# Altium schematic sheet 03- Power Supply.SchDoc: Power Supply
size 420 x 297 mm; DocumentNumber: 2; Revision: 1.0; SheetNumber: 3; SheetTotal: 13; Project: LOW LEVEL ECU
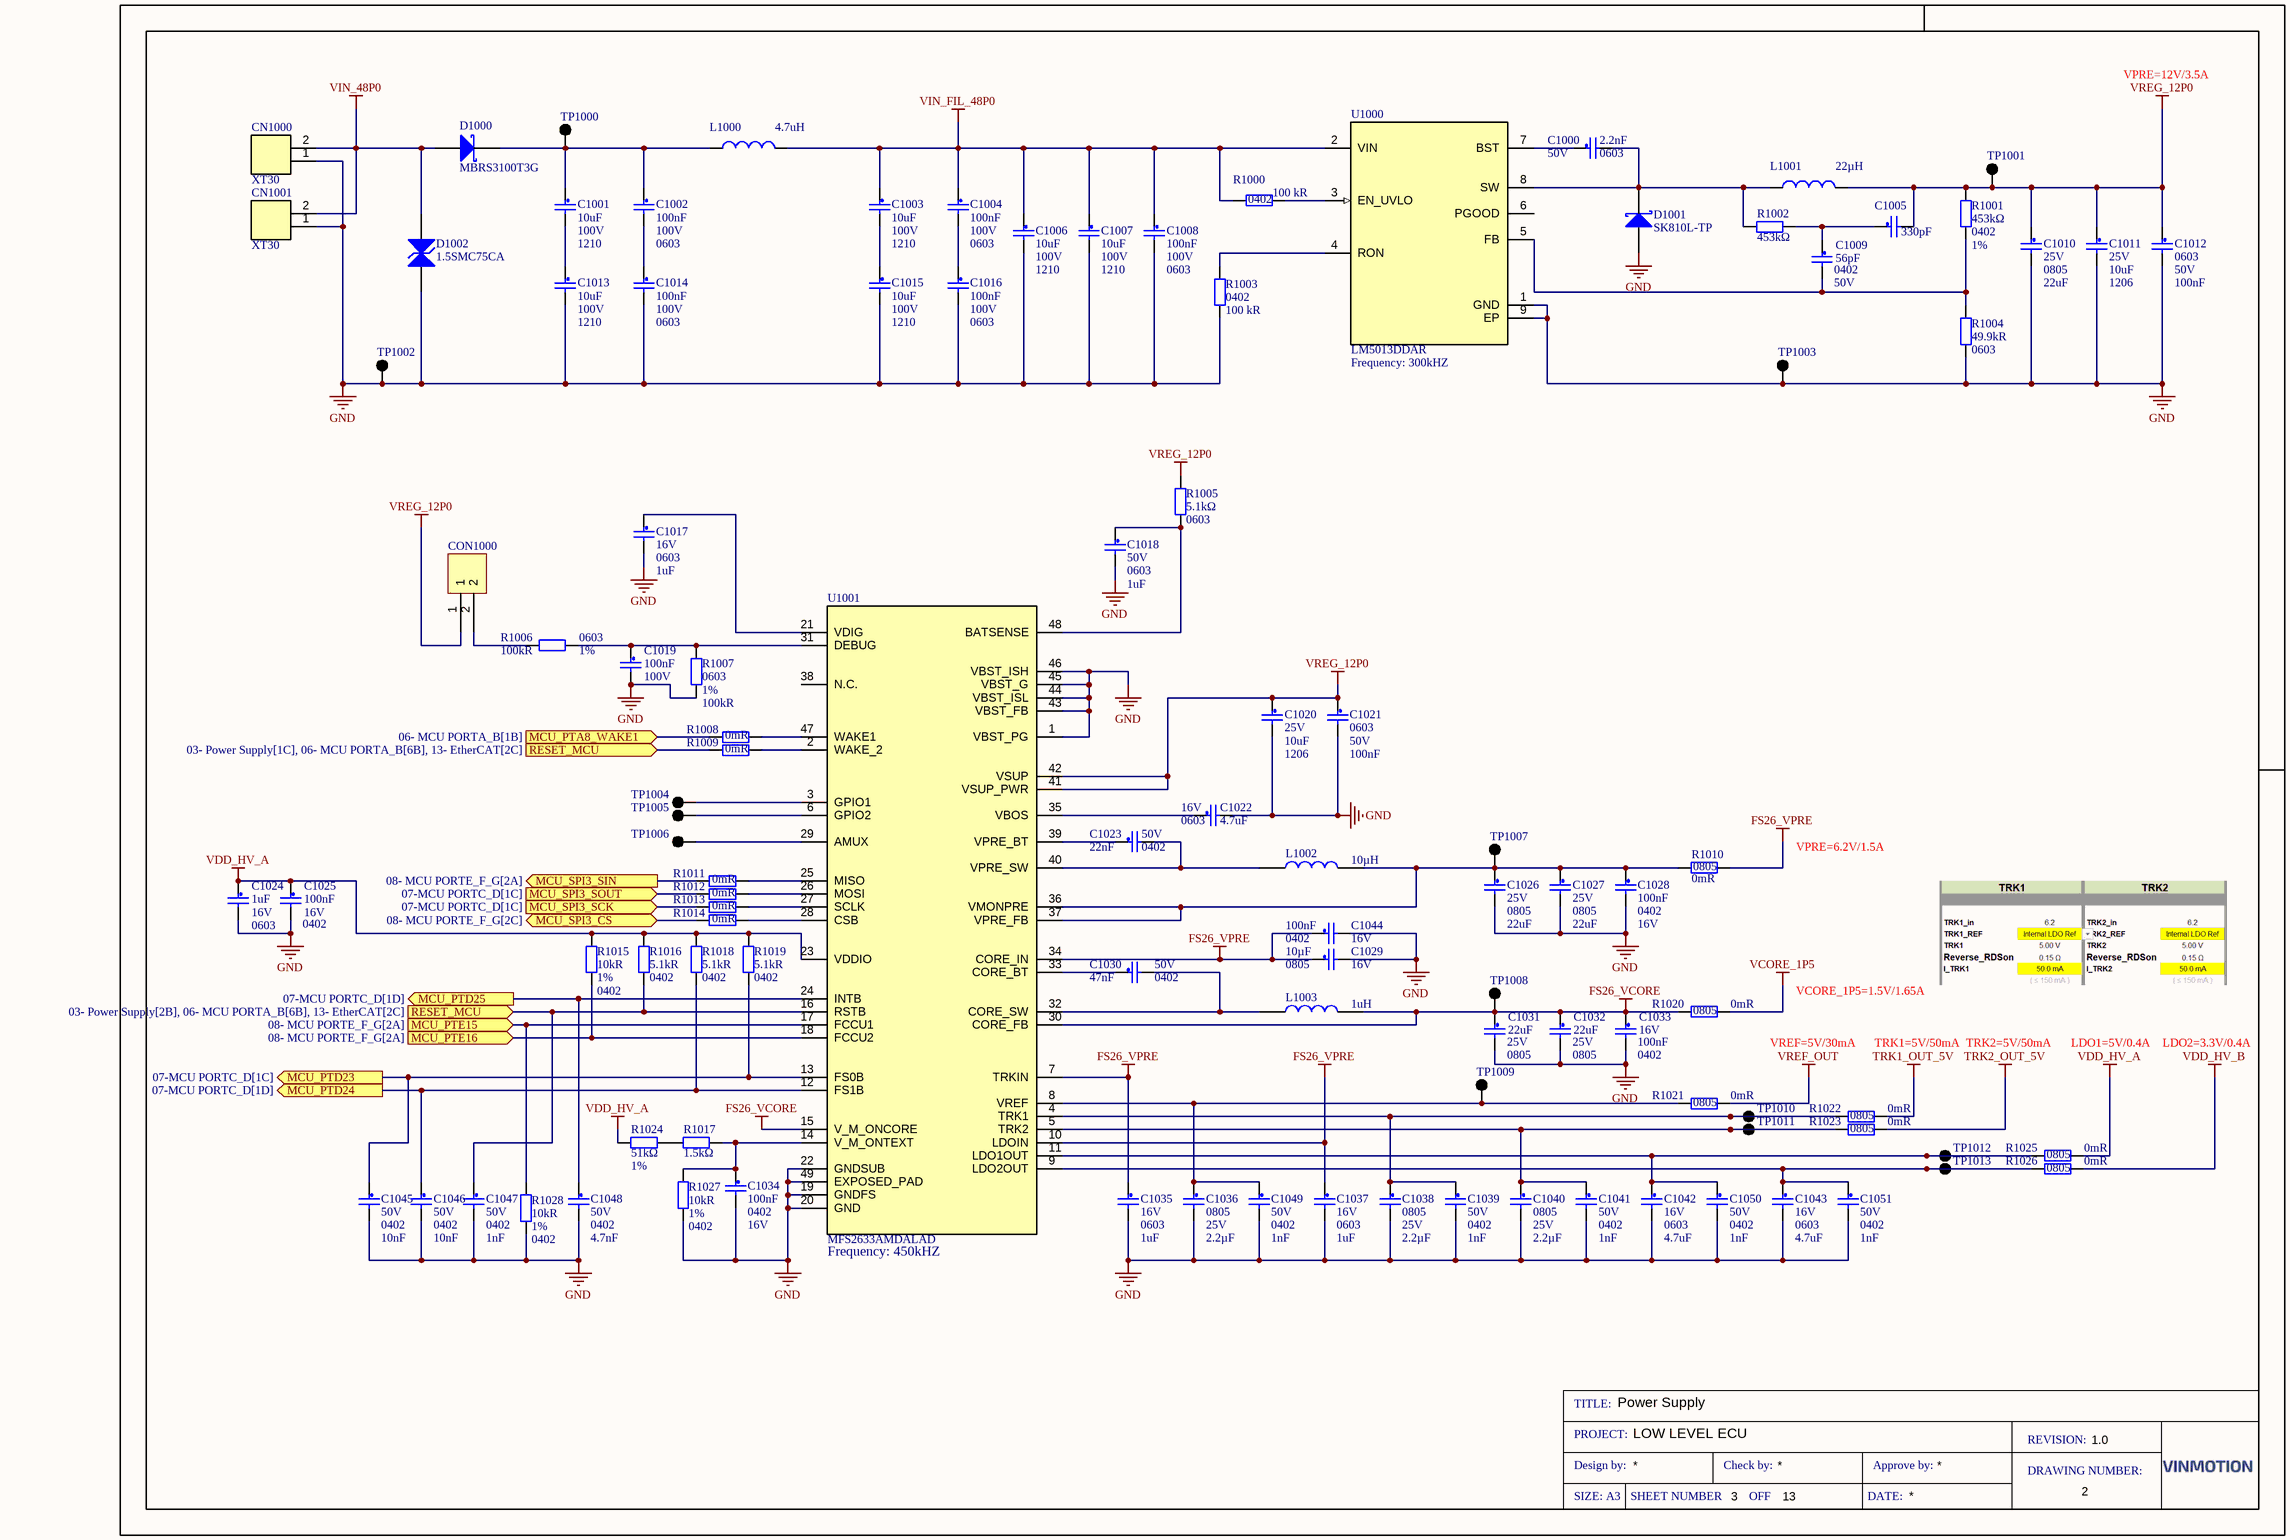
[diagram p0: 03- Power Supply.SchDoc]

## Parts
C1000  Voltage Rating: 50V  Case/Package: 0603  Capacitance: 2.2nF  [CAP0603]  (hidden comment: CL10B222KB8WPNC)
C1001  value 10uF  DC Voltage Rated: 100V  Package: 1210  [CAP1210]  (hidden comment: C3225X7R2A106K250AC)
C1002  value 100nF  Rated DC Voltage (URdc): 100V  Case/Package: 0603  [CAP0603]  (hidden comment: CC0603KRX7R0BB104)
C1003  value 10uF  DC Voltage Rated: 100V  Package: 1210  [CAP1210]  (hidden comment: C3225X7R2A106K250AC)
C1004  value 100nF  Rated DC Voltage (URdc): 100V  Case/Package: 0603  [CAP0603]  (hidden comment: CC0603KRX7R0BB104)
C1005  Capacitance: 330pF  [CAP0603]  (hidden comment: GCM1885C2A331JA16D)
C1006  value 10uF  DC Voltage Rated: 100V  Package: 1210  [CAP1210]  (hidden comment: C3225X7R2A106K250AC)
C1007  value 10uF  DC Voltage Rated: 100V  Package: 1210  [CAP1210]  (hidden comment: C3225X7R2A106K250AC)
C1008  value 100nF  Rated DC Voltage (URdc): 100V  Case/Package: 0603  [CAP0603]  (hidden comment: CC0603KRX7R0BB104)
C1009  Case/Package: 0402  Voltage Rating: 50V  Capacitance: 56pF  [CAP0402]  (hidden comment: GCM1555C1H560JA16D)
C1010  Voltage Rating: 25V  Case/Package: 0805  Capacitance: 22uF  [CAP0805]  (hidden comment: GRM21BR61E226ME44K)
C1011  Voltage Rating (DC): 25V  Capacitance: 10uF  Case Code (Imperial): 1206  [CAP1206]  (hidden comment: GCM31CC71E106KA03L)
C1012  Case/Package: 0603  Voltage Rating: 50V  Capacitance: 100nF  [CAP0603]  (hidden comment: CL10B104KB8WPNC)
C1013  value 10uF  DC Voltage Rated: 100V  Package: 1210  [CAP1210]  (hidden comment: C3225X7R2A106K250AC)
C1014  value 100nF  Rated DC Voltage (URdc): 100V  Case/Package: 0603  [CAP0603]  (hidden comment: CC0603KRX7R0BB104)
C1015  value 10uF  DC Voltage Rated: 100V  Package: 1210  [CAP1210]  (hidden comment: C3225X7R2A106K250AC)
C1016  value 100nF  Rated DC Voltage (URdc): 100V  Case/Package: 0603  [CAP0603]  (hidden comment: CC0603KRX7R0BB104)
C1017  Voltage Rating: 16V  Case/Package: 0603  Capacitance: 1uF  [CAP0603]  (hidden comment: CGA3E1X7R1C105K080AC)
C1018  Voltage Rating: 50V  Case/Package: 0603  Capacitance: 1uF  [CAP0603]  (hidden comment: CL10A105KB8NNNC)
C1019  value 100nF  Rated DC Voltage (URdc): 100V  [CAP0603]  (hidden comment: CC0603KRX7R0BB104)
C1020  Voltage Rating (DC): 25V  Capacitance: 10uF  Case Code (Imperial): 1206  [CAP1206]  (hidden comment: GCM31CC71E106KA03L)
C1021  Case/Package: 0603  Voltage Rating: 50V  Capacitance: 100nF  [CAP0603]  (hidden comment: CL10B104KB8WPNC)
C1022  Voltage Rating: 16V  Case/Package: 0603  Capacitance: 4.7uF  [CAP0603]  (hidden comment: GRT188C81C475KE13D)
C1023  Voltage Rating: 50V  Case/Package: 0402  Capacitance: 22nF  [CAP0402]  (hidden comment: GCM155R71H223KA55D)
C1024  Voltage Rating: 16V  Case/Package: 0603  Capacitance: 1uF  [CAP0603]  (hidden comment: CGA3E1X7R1C105K080AC)
C1025  Capacitance: 100nF  Case/Package: 0402  Voltage Rating (DC): 16V  [CAP0402]  (hidden comment: 0402YC104KAT2A)
C1026  Voltage Rating: 25V  Case/Package: 0805  Capacitance: 22uF  [CAP0805]  (hidden comment: GRM21BR61E226ME44K)
C1027  Voltage Rating: 25V  Case/Package: 0805  Capacitance: 22uF  [CAP0805]  (hidden comment: GRM21BR61E226ME44K)
C1028  Capacitance: 100nF  Case/Package: 0402  Voltage Rating (DC): 16V  [CAP0402]  (hidden comment: 0402YC104KAT2A)
C1029  value 10µF  Case/Package: 0805  Voltage Rating: 16V  [CAP0805]  (hidden comment: GRM21BZ71C106KE15L)
C1030  Voltage Rating: 50V  Case/Package: 0402  Capacitance: 47nF  [CAP0402]  (hidden comment: UMK105B7473KVHF)
C1031  Voltage Rating: 25V  Case/Package: 0805  Capacitance: 22uF  [CAP0805]  (hidden comment: GRM21BR61E226ME44K)
C1032  Voltage Rating: 25V  Case/Package: 0805  Capacitance: 22uF  [CAP0805]  (hidden comment: GRM21BR61E226ME44K)
C1033  Capacitance: 100nF  Case/Package: 0402  Voltage Rating (DC): 16V  [CAP0402]  (hidden comment: 0402YC104KAT2A)
C1034  Capacitance: 100nF  Case/Package: 0402  Voltage Rating (DC): 16V  [CAP0402]  (hidden comment: 0402YC104KAT2A)
C1035  Voltage Rating: 16V  Case/Package: 0603  Capacitance: 1uF  [CAP0603]  (hidden comment: CGA3E1X7R1C105K080AC)
C1036  Case/Package: 0805  Voltage Rating: 25V  Capacitance: 2.2µF  [CAP0805]  (hidden comment: GCM21BR71E225KA73L)
C1037  Voltage Rating: 16V  Case/Package: 0603  Capacitance: 1uF  [CAP0603]  (hidden comment: CGA3E1X7R1C105K080AC)
C1038  Case/Package: 0805  Voltage Rating: 25V  Capacitance: 2.2µF  [CAP0805]  (hidden comment: GCM21BR71E225KA73L)
C1039  Voltage Rating: 50V  Case/Package: 0402  Capacitance: 1nF  [CAP0402]  (hidden comment: UMK105B7102KVHF)
C1040  Case/Package: 0805  Voltage Rating: 25V  Capacitance: 2.2µF  [CAP0805]  (hidden comment: GCM21BR71E225KA73L)
C1041  Voltage Rating: 50V  Case/Package: 0402  Capacitance: 1nF  [CAP0402]  (hidden comment: UMK105B7102KVHF)
C1042  Voltage Rating: 16V  Case/Package: 0603  Capacitance: 4.7uF  [CAP0603]  (hidden comment: GRT188C81C475KE13D)
C1043  Voltage Rating: 16V  Case/Package: 0603  Capacitance: 4.7uF  [CAP0603]  (hidden comment: GRT188C81C475KE13D)
C1044  Capacitance: 100nF  Case/Package: 0402  Voltage Rating (DC): 16V  [CAP0402]  (hidden comment: 0402YC104KAT2A)
C1045  Voltage Rating: 50V  Case/Package: 0402  Capacitance: 10nF  [CAP0402]  (hidden comment: GCM155R71H103KA55D)
C1046  Voltage Rating: 50V  Case/Package: 0402  Capacitance: 10nF  [CAP0402]  (hidden comment: GCM155R71H103KA55D)
C1047  Voltage Rating: 50V  Case/Package: 0402  Capacitance: 1nF  [CAP0402]  (hidden comment: UMK105B7102KVHF)
C1048  Voltage Rating: 50V  Case/Package: 0402  Capacitance: 4.7nF  [CAP0402]  (hidden comment: UMK105B7472KVHF)
C1049  Voltage Rating: 50V  Case/Package: 0402  Capacitance: 1nF  [CAP0402]  (hidden comment: UMK105B7102KVHF)
C1050  Voltage Rating: 50V  Case/Package: 0402  Capacitance: 1nF  [CAP0402]  (hidden comment: UMK105B7102KVHF)
C1051  Voltage Rating: 50V  Case/Package: 0402  Capacitance: 1nF  [CAP0402]  (hidden comment: UMK105B7102KVHF)
CN1000  XT30  [XT30]
CN1001  XT30  [XT30]
CON1000  61300211121  [61300211121-Footprint-1]  (value not drawn)
D1000  MBRS3100T3G  [DIOM6959X26N]
D1001  SK810L-TP  [SMC]
D1002  1.5SMC75CA  [LITTLEFUSE_DO-214AB (SMCJ)_TPSMD18CA_N]
L1000  Inductance: 4.7uH  [INDP4949X20N]  (hidden comment: NRS5040T4R7NMGKV)
L1001  value 22µH  [INDP11X10X6]  (hidden comment: SRP1050WA-220M)
L1002  value 10µH  [INDC548X528X510]  (hidden comment: XAL5050-103MEC)
L1003  value 1uH  [INDP2016X12N]  (hidden comment: TFM201610ALMA1R0MTAA)
R1000  Case/Package: 0402  Resistance: 100 kR  [RES0402]  (hidden comment: RK73B1ETTP104J)
R1001  value 453kΩ  Case/Package: 0402  Tolerance: 1%  [RES0402]  (hidden comment: RC0402FR-13453KL)
R1002  value 453kΩ  [RES0603]  (hidden comment: RC0603FR-07453KL)
R1003  Case/Package: 0402  Resistance: 100 kR  [RES0402]  (hidden comment: RK73B1ETTP104J)
R1004  Resistance: 49.9kR  Case/Package: 0603  [RES0603]  (hidden comment: CRCW060349K9FKEAHP)
R1005  value 5.1kΩ  Case/Package: 0603  [RES0603]  (hidden comment: ESR03EZPJ512)
R1006  Case/Package: 0603  Tolerance: 1%  Resistance: 100kR  [RES0603]  (hidden comment: RMCF0603FG100K)
R1007  Case/Package: 0603  Tolerance: 1%  Resistance: 100kR  [RES0603]  (hidden comment: RMCF0603FG100K)
R1008  Resistance: 0mR  [RES0402]  (hidden comment: RMCF0402ZT0R00)
R1009  Resistance: 0mR  [RES0402]  (hidden comment: RMCF0402ZT0R00)
R1010  Resistance: 0mR  Case/Package: 0805  [RES0805]  (hidden comment: RMCF0805ZT0R00)
R1011  Resistance: 0mR  [RES0402]  (hidden comment: RMCF0402ZT0R00)
R1012  Resistance: 0mR  [RES0402]  (hidden comment: RMCF0402ZT0R00)
R1013  Resistance: 0mR  [RES0402]  (hidden comment: RMCF0402ZT0R00)
R1014  Resistance: 0mR  [RES0402]  (hidden comment: RMCF0402ZT0R00)
R1015  value 10kR  Tolerance: 1%  Case/Package: 0402  [RES0402]  (hidden comment: RMCF0402FT10K0)
R1016  Resistance: 5.1kR  Case/Package: 0402  [RES0402]  (hidden comment: MCR01MZPF5101)
R1017  value 1.5kΩ  [RES0402]  (hidden comment: RC0402FR-071K5L)
R1018  Resistance: 5.1kR  Case/Package: 0402  [RES0402]  (hidden comment: MCR01MZPF5101)
R1019  Resistance: 5.1kR  Case/Package: 0402  [RES0402]  (hidden comment: MCR01MZPF5101)
R1020  Resistance: 0mR  Case/Package: 0805  [RES0805]  (hidden comment: RMCF0805ZT0R00)
R1021  Resistance: 0mR  Case/Package: 0805  [RES0805]  (hidden comment: RMCF0805ZT0R00)
R1022  Resistance: 0mR  Case/Package: 0805  [RES0805]  (hidden comment: RMCF0805ZT0R00)
R1023  Resistance: 0mR  Case/Package: 0805  [RES0805]  (hidden comment: RMCF0805ZT0R00)
R1024  value 51kΩ  Tolerance: 1%  [RES0402]  (hidden comment: AC0402FR-0751KL)
R1025  Resistance: 0mR  Case/Package: 0805  [RES0805]  (hidden comment: RMCF0805ZT0R00)
R1026  Resistance: 0mR  Case/Package: 0805  [RES0805]  (hidden comment: RMCF0805ZT0R00)
R1027  value 10kR  Tolerance: 1%  Case/Package: 0402  [RES0402]  (hidden comment: RMCF0402FT10K0)
R1028  value 10kR  Tolerance: 1%  Case/Package: 0402  [RES0402]  (hidden comment: RMCF0402FT10K0)
TP1000  TP  [TP-SMD-R1]  (value not drawn)  (no BOM)
TP1001  TP  [TP-SMD-R1]  (value not drawn)  (no BOM)
TP1002  TP  [TP-SMD-R1]  (value not drawn)  (no BOM)
TP1003  TP  [TP-SMD-R1]  (value not drawn)  (no BOM)
TP1004  TP  [TP-SMD-R1]  (value not drawn)  (no BOM)
TP1005  TP  [TP-SMD-R1]  (value not drawn)  (no BOM)
TP1006  TP  [TP-SMD-R1]  (value not drawn)  (no BOM)
TP1007  TP  [TP-SMD-R1]  (value not drawn)  (no BOM)
TP1008  TP  [TP-SMD-R1]  (value not drawn)  (no BOM)
TP1009  TP  [TP-SMD-R1]  (value not drawn)  (no BOM)
TP1010  TP  [TP-SMD-R1]  (value not drawn)  (no BOM)
TP1011  TP  [TP-SMD-R1]  (value not drawn)  (no BOM)
TP1012  TP  [TP-SMD-R1]  (value not drawn)  (no BOM)
TP1013  TP  [TP-SMD-R1]  (value not drawn)  (no BOM)
U1000  LM5013DDAR  [SOIC-8]
U1001  MFS2633AMDALAD  [48-LQFP Exposed Pad(7x7)]

## Ports
MCU_PTA8_WAKE1 (in, see 06- MCU PORTA_B[1B]), MCU_PTD23 (out, see 07-MCU PORTC_D[1C]), MCU_PTD24 (out, see 07-MCU PORTC_D[1D]), MCU_PTD25 (out, see 07-MCU PORTC_D[1D]), MCU_PTE15 (in, see 08- MCU PORTE_F_G[2A]), MCU_PTE16 (in, see 08- MCU PORTE_F_G[2A]), MCU_SPI3_CS (bidir, see 08- MCU PORTE_F_G[2C]), MCU_SPI3_SCK (in, see 07-MCU PORTC_D[1C]), MCU_SPI3_SIN (out, see 08- MCU PORTE_F_G[2A]), MCU_SPI3_SOUT (in, see 07-MCU PORTC_D[1C]), RESET_MCU (in, see 03- Power Supply[1C], 06- MCU PORTA_B[6B], 13- EtherCAT[2C]), RESET_MCU (in, see 03- Power Supply[2B], 06- MCU PORTA_B[6B], 13- EtherCAT[2C])

## Nets
FS26_VCORE: C1031.1 C1032.1 C1033.1 L1003.2 R1020.1 TP1008.1 U1001.15(V_M_ONCORE) U1001.30(CORE_FB)
FS26_VPRE: C1029.1 C1035.1 C1037.1 C1044.1 R1010.2 U1001.7(TRKIN) U1001.10(LDOIN) U1001.34(CORE_IN)
GND: C1006.2 C1007.2 C1008.2 C1010.2 C1011.2 C1012.2 C1013.2 C1014.2 C1015.2 C1016.2 C1017.2 C1018.2 C1019.2 C1020.2 C1021.2 C1022.2 C1024.2 C1025.2 C1026.2 C1027.2 C1028.2 C1029.2 C1031.2 C1032.2 C1033.2 C1034.2 C1035.2 C1036.2 C1037.2 C1038.2 C1039.2 C1040.2 C1041.2 C1042.2 C1043.2 C1044.2 C1045.2 C1046.2 C1047.2 C1048.2 C1049.2 C1050.2 C1051.2 CN1000.1 CN1001.1 D1001.2(A) D1002.2 R1003.1 R1004.1 R1007.1 R1027.1 R1028.1 TP1002.1 TP1003.1 U1000.1(GND) U1000.9(EP) U1001.1(VBST_PG) U1001.19(GNDFS) U1001.20(GND) U1001.22(GNDSUB) U1001.43(VBST_FB) U1001.44(VBST_ISL) U1001.45(VBST_G) U1001.46(VBST_ISH) U1001.49(EXPOSED_PAD)
TRK1_OUT_5V: R1022.2
TRK2_OUT_5V: R1023.2
VCORE_1P5: R1020.2
VDD_HV_A: C1024.1 C1025.1 R1015.2 R1016.2 R1018.2 R1019.2 R1024.2 R1025.2 U1001.23(VDDIO)
VDD_HV_B: R1026.2
VIN_48P0: CN1000.2 CN1001.2 D1000.2(A) D1002.1
VIN_FIL_48P0: C1003.1 C1004.1 C1006.1 C1007.1 C1008.1 L1000.2 R1000.1 U1000.2(VIN)
VREF_OUT: R1021.2
VREG_12P0: C1005.2 C1010.1 C1011.1 C1012.1 C1020.1 C1021.1 CON1000.1 L1001.2 R1001.2 R1005.2 TP1001.1 U1001.41(VSUP_PWR) U1001.42(VSUP)
MCU_PTA8_WAKE1: R1008.1 ; port MCU_PTA8_WAKE1
MCU_PTD23: C1045.1 R1019.1 U1001.13(FS0B) ; port MCU_PTD23
MCU_PTD24: C1046.1 R1018.1 U1001.12(FS1B) ; port MCU_PTD24
MCU_PTD25: C1048.1 U1001.24(INTB) ; port MCU_PTD25
MCU_PTE15: R1028.2 U1001.17(FCCU1) ; port MCU_PTE15
MCU_PTE16: R1015.1 U1001.18(FCCU2) ; port MCU_PTE16
MCU_SPI3_CS: R1014.1 ; port MCU_SPI3_CS
MCU_SPI3_SCK: R1013.1 ; port MCU_SPI3_SCK
MCU_SPI3_SIN: R1011.1 ; port MCU_SPI3_SIN
MCU_SPI3_SOUT: R1012.1 ; port MCU_SPI3_SOUT
RESET_MCU: C1047.1 R1009.1 R1016.1 U1001.16(RSTB) ; port RESET_MCU
NetC1000_1: C1000.1 U1000.7(BST)
NetC1000_2: C1000.2 D1001.1(K) L1001.1 R1002.1 U1000.8(SW)
NetC1001_1: C1001.1 C1002.1 D1000.1(K) L1000.1 TP1000.1
NetC1001_2: C1001.2 C1013.1
NetC1002_2: C1002.2 C1014.1
NetC1003_2: C1003.2 C1015.1
NetC1004_2: C1004.2 C1016.1
NetC1005_1: C1005.1 C1009.1 R1002.2
NetC1009_2: C1009.2 R1001.1 R1004.2 U1000.5(FB)
NetC1017_1: C1017.1 U1001.21(VDIG)
NetC1018_1: C1018.1 R1005.1 U1001.48(BATSENSE)
NetC1019_1: C1019.1 R1006.2 R1007.2 U1001.31(DEBUG)
NetC1022_1: C1022.1 U1001.35(VBOS)
NetC1023_1: C1023.1 U1001.39(VPRE_BT)
NetC1023_2: C1023.2 L1002.1 U1001.40(VPRE_SW)
NetC1026_1: C1026.1 C1027.1 C1028.1 L1002.2 R1010.1 TP1007.1 U1001.36(VMONPRE) U1001.37(VPRE_FB)
NetC1030_1: C1030.1 U1001.33(CORE_BT)
NetC1030_2: C1030.2 L1003.1 U1001.32(CORE_SW)
NetC1034_1: C1034.1 R1017.1 R1027.2 U1001.14(V_M_ONTEXT)
NetC1036_1: C1036.1 C1049.1 R1021.1 TP1009.1 U1001.8(VREF)
NetC1038_1: C1038.1 C1039.1 R1022.1 TP1010.1 U1001.4(TRK1)
NetC1040_1: C1040.1 C1041.1 R1023.1 TP1011.1 U1001.5(TRK2)
NetC1042_1: C1042.1 C1050.1 R1025.1 TP1012.1 U1001.11(LDO1OUT)
NetC1043_1: C1043.1 C1051.1 R1026.1 TP1013.1 U1001.9(LDO2OUT)
NetCON1000_2: CON1000.2 R1006.1
NetR1000_2: R1000.2 U1000.3(EN_UVLO)
NetR1003_2: R1003.2 U1000.4(RON)
NetR1008_2: R1008.2 U1001.47(WAKE1)
NetR1009_2: R1009.2 U1001.2(WAKE_2)
NetR1011_2: R1011.2 U1001.25(MISO)
NetR1012_2: R1012.2 U1001.26(MOSI)
NetR1013_2: R1013.2 U1001.27(SCLK)
NetR1014_2: R1014.2 U1001.28(CSB)
NetR1017_2: R1017.2 R1024.1
NetTP1004_1: TP1004.1 U1001.3(GPIO1)
NetTP1005_1: TP1005.1 U1001.6(GPIO2)
NetTP1006_1: TP1006.1 U1001.29(AMUX)

Not connected (* = marked no-connect by the designer): U1000 6(PGOOD); U1001 38(N.C.)

## Notes on the sheet
- VPRE=12V/3.5A
- (near U1000) Frequency: 300kHZ
- VPRE=6.2V/1.5A
- VCORE_1P5=1.5V/1.65A
- VREF=5V/30mA
- TRK1=5V/50mA
- TRK2=5V/50mA
- LDO1=5V/0.4A
- LDO2=3.3V/0.4A
- (near U1001) Frequency: 450kHZ
- TITLE:
- PROJECT:
- Design by:
- Check by:
- Approve by:
- DRAWING NUMBER:
- REVISION:
- SIZE: A3
- SHEET NUMBER
- OFF
- DATE:

## Library data of the parts
C1000 = CMP-00248-3: CAP CER 2200PF 50V X7R 0603; Manufacturer 1: Samsung; Mount Type(SMD/TH): SMD; Crossable(YES/NO): YES; Tolerance: 10%; Width: 0.031inch; Mount: Surface Mount; Packaging: Tape and Reel; Dielectric: X7R; Max Operating Temperature: 125°C; Radiation Hardening: No; Thickness: 0.035inch; Min Operating Temperature: -55°C; Manufacturer Part Number 1: CL10B222KB8WPNC; Case Code (Metric): 1608; Ratings: AEC-Q200; Features: Soft Termination; Case Code (Imperial): 0603; Depth: 0.8mm; Length: 0.063inch; Height: 0.8mm; Lead Free: Lead Free; Voltage Rating (DC): 50V
C1001 C1003 C1006 C1007 C1013 C1015 = CMP-01079-1: CAP CER 10UF 100V X7R 1210; Manufacturer: TDK; Manufacturer Part Number: C3225X7R2A106K250AC; Category: Ceramic Capacitors
C1002 C1004 C1008 C1014 C1016 C1019 = CMP-01080-1: CAP CER 0.1UF 100V X7R 0603; Manufacturer: Yageo; Capacitor Type: Ceramic; Multilayer: Yes; Tolerance  (fill in as +-): 10%; JESD-609 Code: e3; Category: Ceramic Capacitors; Dielectric Material: Ceramic; Height: 0.8mm; Length: 1.6mm; Manufacturer Part Number: CC0603KRX7R0BB104; Max Operating Temperature: 125°C; Min Operating Temperature: -55°C; Mounting Technology: Surface Mount; Pins: 2; Package Shape: Rectangular; Package Style: SMTMeter; Packaging: Tape and Reel; Tolerance (fill in as +-): 10%; Reach SVHC Compliant: Yes; RoHS Compliant: Yes; Temperature Characteristics Code: X7R; Terminal Finish: Nickel; Termination: Wraparound; Width: 0.8mm
  C1019: Case/Package: 0603
C1005 = CMP-00223-4: CAP CER 330pF 100V 5% C0G 0603 SMD; Manufacturer 1: Murata Electronics; Crossable(YES/NO): YES; Mount: Surface Mount; Length: 1.6mm; Max Operating Temperature: 125°C; Tolerance: 5%; Weight: 7.1E-05oz; Thickness: 0.035inch; Width: 0.8mm; Depth: 0.8mm; Case Code (Metric): 1608; Radiation Hardening: No; Voltage Rating (DC): 100V; Min Operating Temperature: -55°C; Manufacturer Part Number 1: GCM1885C2A331JA16D; Packaging: Tape and Reel; Mount Type(SMD/TH): SMD; Height: 0.8mm; Termination: SMD/SMT; Ratings: AEC-Q200; Case Code (Imperial): 0603; Package Quantity: 1; Dielectric: C0G; Lead Free: Lead Free; Voltage Rating: 100V; Case/Package: 0603
C1009 = CMP-00911-1: CAP CER 56PF 50V C0G/NP0 0402; Manufacturer 1: Murata Electronics; Crossable(YES/NO): YES; Mount Type(SMD/TH): SMD; Dielectric: C0G; Tolerance: 5%; Manufacturer Part Number 1: GCM1555C1H560JA16D; Min Operating Temperature: -55°C; Max Operating Temperature: 125°C; Supplier 1: Digi-Key; Stock 1: 75588; Pricing 1: 1=0.10000, 10=0.05900, 50=0.03240, 100=0.02650, 500=0.01892, 1000=0.01487, 2500=0.01352, 5000=0.01244 (USD); RoHS: Yes; Mount: Surface Mount; Weight: 0.000212oz; Case Code (Metric): 1005; Case Code (Imperial): 0402; Packaging: Tape and Reel; Termination: SMD/SMT; Voltage Rating (DC): 50V; Package Quantity: 10000; Length: 0.039inch; Height: 0.5mm; Width: 0.5mm; Thickness: 0.022inch; Ratings: AEC-Q200; ComponentLink1URL: http://www.mouser.com/ds/2/281/c03e-806517.pdf?src-supplier=Mouser; ComponentLink1Description: http://www.mouser.com/ds/2/281/c03e-806517.pdf?src-supplier=Mouser; ComponentLink2URL: http://www.murata.com/~/media/webrenewal/support/library/catalog/products/capacitor/mlcc/c03e.ashx?src-supplier=Digi-Key; ComponentLink2Description: http://www.murata.com/~/media/webrenewal/support/library/catalog/products/capacitor/mlcc/c03e.ashx?src-supplier=Digi-Key; ComponentLink3URL: http://search.murata.co.jp/Ceramy/image/img/A01X/partnumbering_e_02.pdf?src-supplier=Digi-Key; ComponentLink3Description: http://search.murata.co.jp/Ceramy/image/img/A01X/partnumbering_e_02.pdf?src-supplier=Digi-Key; Supplier Part Number 1: 490-13291-1-ND; Lead Free: Lead Free
C1010 C1026 C1027 C1031 C1032 = CMP-ROOT-0068-6: CAP CER 22uF 25V 20% X5R 0805 SMD; Manufacturer 1: Murata Electronics; Crossable(YES/NO): YES; Height: 1.25mm; Length: 0.079inch; Max Operating Temperature: 85°C; Tolerance: 20%; Mount Type(SMD/TH): SMD; Manufacturer Part Number 1: GRM21BR61E226ME44K; Weight: 0.000335oz; Dielectric: X5R; Packaging: Tape and Reel; Package Quantity: 10000; Mount: Surface Mount; Termination: SMD/SMT; Composition: Ceramic; Case Code (Imperial): 0805; Thickness: 0.057inch; Voltage Rating (DC): 25V; Case Code (Metric): 2012; Width: 1.25mm; Min Operating Temperature: -55°C; Lead Free: Lead Free
C1011 C1020 = CMP-00214-1: CAP CER 10UF 25V X7S 1206; Manufacturer 1: Murata Electronics; Mount Type(SMD/TH): SMD; Crossable(YES/NO): YES; Tolerance: 10%; Dielectric: X7S; Thickness: 0.075inch; Package Quantity: 2000; Min Operating Temperature: -55°C; Packaging: Tape and Reel; Weight: 0.001411oz; Length: 0.126inch; Height: 1.25mm; Manufacturer Part Number 1: GCM31CC71E106KA03L; Termination: SMD/SMT; Width: 0.063inch; Ratings: AEC-Q200; Voltage Rating: 25V; Case Code (Metric): 3216; Mount: Surface Mount; Max Operating Temperature: 125°C; Case/Package: 1206
C1012 C1021 = CMP-00005-5: CAP CER 0.1UF 50V X7R 0603; Manufacturer 1: Samsung; Mount Type(SMD/TH): SMD; Crossable(YES/NO): YES; Tolerance: 10%; Length: 0.063inch; Mount: Surface Mount; Thickness: 0.035inch; Max Operating Temperature: 125°C; Lead Free: Lead Free; Ratings: AEC-Q200; Min Operating Temperature: -55°C; Case Code (Metric): 1608; Features: Soft Termination; Case Code (Imperial): 0603; Width: 0.031inch; Manufacturer Part Number 1: CL10B104KB8WPNC; Packaging: Tape and Reel; Height: 0.8mm; Voltage Rating (DC): 50V
C1017 C1024 C1035 C1037 = CMP-00042-2: CAP CER 1uF 16V X7R 0603; Manufacturer 1: TDK Corporation; Crossable(YES/NO): YES; Tolerance: 10%; Mount Type(SMD/TH): SMD; Case Code (Imperial): 0603; Manufacturer Part Number 1: CGA3E1X7R1C105K080AC; Ratings: AEC-Q200; REACH SVHC: No SVHC; Lead Free: Lead Free; Mount: Surface Mount; Package Quantity: 4000; Packaging: Tape and Reel; Weight: 7.1E-05oz; Voltage Rating (DC): 16V; Width: 0.8mm; Height: 0.8mm; Length: 0.063inch; Max Operating Temperature: 125°C; Case Code (Metric): 1608; Min Operating Temperature: -55°C; Dielectric: X7R; Termination: SMD/SMT; Thickness: 0.035inch
C1018 = CMP-00313-1: CAP CER 1UF 50V X5R 0603; Manufacturer 1: Samsung; Crossable(YES/NO): YES; Tolerance: 10%; Mount Type(SMD/TH): SMD; Thickness: 0.035inch; Mount: Surface Mount; Dielectric: X5R; Packaging: Tape and Reel; Depth: 0.8mm; Termination: Wraparound; Max Operating Temperature: 85°C; Width: 0.031inch; Manufacturer Part Number 1: CL10A105KB8NNNC; Min Operating Temperature: -55°C; Length: 1.6mm; Case Code (Imperial): 0603; Case Code (Metric): 1608; Package Quantity: 1; Radiation Hardening: No; Contact Plating: Tin; Height: 0.8mm; Lead Free: Lead Free; Voltage Rating (DC): 50V
C1022 C1042 C1043 = CMP-00351-2: CAP CER 4.7uF 16V 10% X6S 0603 SMD; Manufacturer 1: Murata Electronics; Crossable(YES/NO): YES; Case Code (Imperial): 0603; Tolerance: 10%; Packaging: Tape and Reel; Width: 0.031inch; Case Code (Metric): 1608; Mount Type(SMD/TH): SMD; Min Operating Temperature: -55°C; Max Operating Temperature: 105°C; Mount: Surface Mount; Thickness: 0.035inch; Manufacturer Part Number 1: GRT188C81C475KE13D; Ratings: AEC-Q200; Length: 0.063inch; Height: 0.8mm; Lead Free: Lead Free; Voltage Rating (DC): 16V
C1023 = CMP-00784-1: CAP CER 0.022UF 50V X7R 0402; Manufacturer 1: Murata Electronics; Crossable(YES/NO): YES; Tolerance: 10%; Mount Type(SMD/TH): SMD; Dielectric: X7R; Height: 0.5mm; Case Code (Metric): 1005; Depth: 0.5mm; Radiation Hardening: No; Length: 1mm; Thickness: 0.022inch; Width: 0.02inch; Manufacturer Part Number 1: GCM155R71H223KA55D; Mount: Surface Mount; Min Operating Temperature: -55°C; Voltage: 50V; Voltage Rating (DC): 50V; Termination: SMD/SMT; Max Operating Temperature: 125°C; Case Code (Imperial): 0402; Lead Free: Lead Free; Packaging: Tape and Reel; Ratings: AEC-Q200; Package Quantity: 10000
C1025 C1028 C1033 C1034 C1044 = CMP-00988-1: CAP CER 0.1UF 16V X7R 0402; Manufacturer 1: KYOCERA AVX; Crossable(YES/NO): YES; Mount Type(SMD/TH): SMD; Case Code (Imperial): 0402; Case Code (Metric): 1005; Dielectric: X7R; Manufacturer Part Number 1: 0402YC104KAT2A; Max Operating Temperature: 125°C; Min Operating Temperature: -55°C; Mount: Surface Mount; Voltage Rating: 16V
C1029 = CMP-01170-1: CAP CER 10UF 16V X7R 0805; Manufacturer: Murata; Manufacturer Lifecycle Status: IN PRODUCTION; Dielectric Material: Ceramic; Tolerance: 10%; Length: 2mm; Category: Ceramic Capacitors; Height: 1.25mm; Lifecycle Status: Production; Manufacturer Part Number: GRM21BZ71C106KE15L; Material: Ceramic; Max Operating Temperature: 125°C; Min Operating Temperature: -55°C; Mounting Technology: Surface Mount; Number of Terminals: 2; REACH SVHC: Yes; RoHS: Compliant; Thickness: 1.25mm; Voltage Rating (DC): 16V; Width: 1.25mm
C1030 = CMP-00420-2: CAP CER 0.047UF 50V X7R 0402; Manufacturer 1: Taiyo Yuden; Tolerance: 10%; Mount Type(SMD/TH): SMD; Crossable(YES/NO): YES; Ratings: AEC-Q200; Case Code (Metric): 1005; Case Code (Imperial): 0402; Termination: Wraparound; Length: 0.039inch; Manufacturer Part Number 1: UMK105B7473KVHF; Mount: Surface Mount; Min Operating Temperature: -55°C; Width: 0.02inch; Thickness: 0.022inch; Packaging: Tape and Reel; Max Operating Temperature: 125°C; Dielectric: X7R; Contact Plating: Tin; Height: 0.5mm; Lead Free: Lead Free; Voltage Rating (DC): 50V
C1036 C1038 C1040 = CMP-00931-1: CAP CER 2.2UF 25V X7R 0805; Manufacturer 1: Murata Electronics; Crossable(YES/NO): YES; Mount Type(SMD/TH): SMD; Tolerance: 10%; Manufacturer Part Number 1: GCM21BR71E225KA73L; Min Operating Temperature: -55°C; Max Operating Temperature: 125°C; Supplier 1: Digi-Key; Stock 1: 829413; Pricing 1: 1=0.61000, 10=0.43300, 50=0.32720, 100=0.28510, 500=0.21116, 1000=0.17948 (USD); RoHS: Yes; Mount: Surface Mount; Case Code (Metric): 2012; Case Code (Imperial): 0805; Dielectric: X7R; Packaging: Tape and Reel; Package Quantity: 1; Voltage Rating (DC): 25V; Termination: SMD/SMT; Voltage: 25V; Length: 2mm; Height: 1.25mm; Width: 0.049inch; Thickness: 0.055inch; Depth: 1.25mm; Ratings: AEC-Q200; Radiation Hardening: No; REACH SVHC: No SVHC; Lead Free: Lead Free; ComponentLink1URL: https://datasheet.ciiva.com/11787/0900766b80ef92d0-11787425.pdf?src-supplier=RSComponents; ComponentLink1Description: https://datasheet.ciiva.com/11787/0900766b80ef92d0-11787425.pdf?src-supplier=RSComponents; ComponentLink2URL: https://datasheet.ciiva.com/16624/product-16624577.pdf?src-supplier=Avnet+Europe; ComponentLink2Description: https://datasheet.ciiva.com/16624/product-16624577.pdf?src-supplier=Avnet+Europe; ComponentLink3URL: https://datasheet.ciiva.com/18183/getdatasheetpartid-317885-18183700.pdf?src-supplier=Verical; ComponentLink3Description: https://datasheet.ciiva.com/18183/getdatasheetpartid-317885-18183700.pdf?src-supplier=Verical; ComponentLink4URL: https://datasheet.ciiva.com/140/product-140422.pdf?src-supplier=Digi-Key; ComponentLink4Description: https://datasheet.ciiva.com/140/product-140422.pdf?src-supplier=Digi-Key; ComponentLink5URL: https://datasheet.ciiva.com/140/product-140423.pdf?src-supplier=Digi-Key; ComponentLink5Description: https://datasheet.ciiva.com/140/product-140423.pdf?src-supplier=Digi-Key; ComponentLink6URL: https://datasheet.ciiva.com/140/product-140424.pdf?src-supplier=Digi-Key; ComponentLink6Description: https://datasheet.ciiva.com/140/product-140424.pdf?src-supplier=Digi-Key; ComponentLink7URL: https://datasheet.ciiva.com/11463/product-11463815.pdf?src-supplier=Avnet; ComponentLink7Description: https://datasheet.ciiva.com/11463/product-11463815.pdf?src-supplier=Avnet; Supplier Part Number 1: 490-4787-1-ND
C1039 C1041 C1047 C1049-C1051 = CMP-ROOT-0049-5: CAP CER 1nF 50V 10% X7R 0402 SMD; Manufacturer 1: Taiyo Yuden; Crossable(YES/NO): YES; Mount Type(SMD/TH): SMD; Halogen Free: Halogen Free; Thickness: 0.022inch; Width: 0.02inch; Max Operating Temperature: 125°C; Case Code (Metric): 1005; Voltage Rating (DC): 50V; Dielectric: X7R; Ratings: AEC-Q200; Lead Free: Lead Free; Termination: SMD/SMT; Length: 0.039inch; Packaging: Tape and Reel; Tolerance: 10%; Mount: Surface Mount; Weight: 2.3E-05oz; Case Code (Imperial): 0402; Package Quantity: 10000; Manufacturer Part Number 1: UMK105B7102KVHF; Min Operating Temperature: -55°C; Height: 0.5mm
C1045 C1046 = CMP-00887-1: CAP CER 10000PF 50V X7R 0402; Manufacturer 1: Murata Electronics; Crossable(YES/NO): YES; Mount Type(SMD/TH): SMD; Tolerance: 10%; Width: 0.02inch; Packaging: Tape and Reel; Dielectric: X7R; Mount: Surface Mount; Thickness: 0.022inch; Ratings: AEC-Q200; Height: 0.5mm; Manufacturer Part Number 1: GCM155R71H103KA55D; Package Quantity: 1; Depth: 0.5mm; REACH SVHC: No SVHC; Length: 1mm; Lead Free: Lead Free; Max Operating Temperature: 125°C; Voltage: 50V; Case Code (Imperial): 0402; Termination: SMD/SMT; Min Operating Temperature: -55°C; Voltage Rating (DC): 50V; Case Code (Metric): 1005; Radiation Hardening: No
C1048 = CMP-00455-2: CAP CER 4.7nF 50V 10% X7R 0402 SMD; Manufacturer 1: Taiyo Yuden; Crossable(YES/NO): YES; Weight: 2.3E-05oz; Max Operating Temperature: 125°C; Width: 0.02inch; Min Operating Temperature: -55°C; Mount: Surface Mount; Halogen Free: Halogen Free; Voltage Rating (DC): 50V; Tolerance: 10%; Lead Free: Lead Free; Thickness: 0.022inch; Packaging: Tape and Reel; Height: 0.5mm; Ratings: AEC-Q200; Termination: SMD/SMT; Mount Type(SMD/TH): SMD; Length: 0.039inch; Package Quantity: 10000; Case Code (Metric): 1005; Dielectric: X7R; Case Code (Imperial): 0402; Manufacturer Part Number 1: UMK105B7472KVHF
CN1000 CN1001 = CMP-01151-1: XT30 CONNECTOR
CON1000 = CMP-00162-3: CONN HEADER VERT 2POS 2.54MM; Manufacturer 1: Wurth Electronics; Crossable(YES/NO): NO; Mount Type(SMD/TH): TH; Manufacturer Part Number 1: 61300211121; Max Operating Temperature: *; Min Operating Temperature: *
D1000 = CMP-01162-1: DIODE SCHOTTKY 100V 3A SMC; Manufacturer: onsemi; Manufacturer Lifecycle Status: ACTIVE; Element Configuration: Single; Forward Voltage: 620mV; Max Forward Surge Current (Ifsm): 130A; Max Reverse Leakage Current: 50µA; Number of Elements: 1; Polarity: Standard; China RoHS: Non-Compliant; Average Rectified Current: 3A; Case/Package: SMC; Category: Schottky Diodes; Contact Plating: Tin; Current Rating: 3A; Forward Current: 3A; Halogen Free: Halogen Free; Height: 2.13mm; Lead Free: Lead Free; Length: 6.86mm; Lifecycle Status: Production; Manufacturer Part Number: MBRS3100T3G; Max Operating Temperature: 175°C; Max Output current: 3A; Max Repetitive Reverse Voltage (Vrrm): 100V; Max Reverse Voltage (DC): 100V; Max Surge Current: 130A; Min Operating Temperature: -65°C; Pins: 2; Number of Terminals: 2; Output Current: 3A; Packaging: Tape and Reel; Peak Non-Repetitive Surge Current: 130A; Peak Reverse Current: 50µA; Radiation Hardening: No; REACH SVHC: No; Reverse Standoff Voltage: 100V; RoHS: Compliant; Schedule B: 8541100080, 8541100080|8541100080|8541100080|8541100080|8541100080|8541100080|8541100080|8541100080|8541100080|8541100080|8541100080|8541100080|8541100080|8541100080|8541100080|8541100080|8541100080|8541100080|8541100080|8541100080|8541100080|8541100080|8541100080|85; Termination: SMD/SMT; Voltage Rating (DC): 100V; Width: 5.84mm
D1001 = CMP-01180-1: DIODE SCHOTTKY 100V 8A DO214AB; Manufacturer: MCC; Forward Voltage: 800mV; Element Configuration: Single; Max Forward Surge Current (Ifsm): 200A; Number of Elements: 1; Peak Reverse Current: 100µA; Average Rectified Current: 8A; Case/Package: SMC; Category: Rectifier Diodes; China RoHS: Non-Compliant; Forward Current: 8A; Lead Free: Lead Free; Lifecycle Status: Production; Manufacturer Part Number: SK810L-TP; Max Operating Temperature: 150°C; Max Output current: 8A; Max Repetitive Reverse Voltage (Vrrm): 100V; Max Reverse Voltage (DC): 100V; Min Operating Temperature: -55°C; Mounting Technology: Surface Mount; Number of Terminals: 2; REACH SVHC: No; Reverse Standoff Voltage: 100V; RoHS: Compliant; Schedule B: 8541100080, 8541100080|8541100080|8541100080|8541100080|8541100080; Weight: 234.989197mg
D1002 = CMP-01163-1: TVS DIODE 64.1VWM 103V DO214AB; Manufacturer: Littelfuse; Breakdown Voltage: 75V; Direction: Bidirectional; Leakage Current: 1µA; Max Breakdown Voltage: 78.8V; Max Power Dissipation: 6.5W; Max Surge Current: 14.8A; Min Breakdown Voltage: 71.3V; Number of Bidirectional Channels: 1; Operating Supply Voltage: 6.4V; Peak Pulse Power: 1.5kW; Power Line Protection: No; Reverse Standoff Voltage: 64.1V; Test Current: 1mA; Lifecycle Status: Production; Category: TVS Diodes; China RoHS: Non-Compliant; Clamping Voltage: 103V; Composition: Zener; Height: 2.62mm; Lead Free: Lead Free; Length: 8.13mm; Manufacturer Part Number: 1.5SMC75CA; Max Operating Temperature: 150°C; Max Reverse Leakage Current: 1µA; Min Operating Temperature: -65°C; Mounting Technology: Surface Mount; Number of Channels: 1; Number of Elements: 1; Pins: 2; Number of Terminals: 2; Peak Pulse Current: 14.8A; Peak Reverse Current: 1µA; Polarity: Bidirectional; Power Dissipation: 1.5kW; Power Rating: 1.5kW; REACH SVHC: No; Reverse Breakdown Voltage: 71.3V; Reverse Voltage: 64.1V; RoHS: Compliant; Termination: SMD/SMT; Voltage Rating (DC): 75V; Width: 6.22mm
L1000 = CMP-00882-1: FIXED IND 4.7UH 3.1A 37.7 MOHM; Manufacturer 1: Taiyo Yuden; Test Frequency: 100kHz; DC Resistance (DCR): 37.7mR; Crossable(YES/NO): YES; Core Material: Ferrite; Mount Type(SMD/TH): SMD; Saturation Current: 3.3A; Tolerance: 30%; Self Resonant Frequency: 28MHz; Shielding: Shielded; Current Rating: 3.1A; Termination: SMD/SMT; Mount: Surface Mount; Min Operating Temperature: -40°C; Width: 0.193inch; Height: 4mm; Length: 0.193inch; Packaging: Tape and Reel; Package Quantity: 1500; Manufacturer Part Number 1: NRS5040T4R7NMGKV; Halogen Free: Halogen Free; Max Operating Temperature: 125°C; Composition: Wirewound; Max DC Current: 3.1A; Case/Package: Nonstandard; Depth: 4.9mm; Radiation Hardening: No; Ratings: AEC-Q200; Height - Seated (Max): 0.161inch
L1001 = CMP-01179-1: IND POWER HC 22UH 6A SHLD; Manufacturer: Bourns; DC Resistance (DCR): 50mΩ; Number of Circuits: 1; Q Factor: 20; Saturation Current: 8.8A; Self Resonant Frequency: 7MHz; Shielding: Yes; Test Frequency: 100kHz; Tolerance: 20%; Lifecycle Status: Production; Category: Fixed Inductors; Height: 5.1mm; Manufacturer Part Number: SRP1050WA-220M; Max Current Rating: 6A; Max Operating Temperature: 165°C; Min Operating Temperature: -55°C; Number of Terminals: 2; REACH SVHC: Yes; RMS Current (Irms): 6A; RoHS: Compliant; ESR: 50mΩ; Width: 10mm
L1002 = CMP-01169-1: FIXED IND 10UH 4.9A 45MOHM SM; Manufacturer: Coilcraft; DC Resistance (DCR): 45mΩ; Core Material: Composite; Inductance Tolerance: 20%; Number of Circuits: 1; Self Resonant Frequency: 15MHz; Shielding: Yes; Test Frequency: 1MHz; Ambient Temperature Range High: 125°C; Case/Package: SMD/SMT; Category: Fixed Inductors; Height: 5.1mm; Lead Free: Contains Lead; Length: 5.68mm; Lifecycle Status: Production; Manufacturer Part Number: XAL5050-103MEC; Max Current Rating: 4.9A; Max DC Current: 4.9A; Max Operating Temperature: 125°C; Min Operating Temperature: -40°C; Mounting Technology: Surface Mount; Number of Terminals: 2; Packaging: Cut Tape; REACH SVHC: Yes; RMS Current (Irms): 4.9A; RoHS: Compliant; Saturation Current: 4.9A; ESR: 45mΩ; Termination: SMD/SMT; Tolerance: 20%; Width: 5.28mm
L1003 = CMP-01171-1: FIXED IND 1UH 3.1A 60 MOHM SMD; Manufacturer: TDK; Manufacturer Lifecycle Status: PRODUCTION; Core Material: Metal; Current Rating: 3.7A; DC Resistance (DCR): 60mΩ; Number of Circuits: 1; Saturation Current: 3.3A; Shielding: Yes; Test Frequency: 1MHz; Tolerance: 20%; Case/Package: 0806; Case Code (Imperial): 0806; Case Code (Metric): 2016; Category: Fixed Inductors; Composition: Thin Film; Height: 1mm; Height - Seated (Max): 990.6µm; Length: 2mm; Lifecycle Status: Production; Manufacturer Part Number: TFM201610ALMA1R0MTAA; Max Current Rating: 3.1A; Max Length: 2.2mm; Max Operating Temperature: 150°C; Max Width: 1.8mm; Min Length: 1.8mm; Min Operating Temperature: -55°C; Min Width: 1.4mm; Mounting Technology: Surface Mount; Number of Terminals: 2; Ratings: AEC-Q200; REACH SVHC: Yes; RoHS: Compliant; Schedule B: 8504500000, 8504500000|8504500000|8504500000|8504500000|8504500000; Width: 1.6mm
R1000 R1003 = CMP-00899-1: RES 100K OHM 5% 1/10W 0402; Manufacturer 1: KOA Speer Electronics, Inc.; Power Rating: 0.1W; Crossable(YES/NO): YES; Mount Type(SMD/TH): SMD; Temperature Coefficient: 200ppm/°C; Voltage Rating (DC): 50V; Manufacturer Part Number 1: RK73B1ETTP104J; Min Operating Temperature: -55°C; Max Operating Temperature: 155°C; Supplier 1: Digi-Key; Stock 1: 503059; Pricing 1: 1=0.10000, 10=0.01600, 100=0.00650, 1000=0.00292, 2500=0.00253, 5000=0.00209 (USD); RoHS: Yes; Mount: Surface Mount; Case Code (Imperial): 0402; Case Code (Metric): 1005; Packaging: Tape and Reel; Package Quantity: 10000; Tolerance: 5%; Composition: Thick Film; Termination: SMD/SMT; Military Standard: MIL-R-55342F; Length: 1mm; Height: 0.35mm; Width: 0.5mm; Depth: 0.5mm; Lead Free: Lead Free; ComponentLink1URL: https://datasheet.ciiva.com/34302/1876768-34302941.pdf?src-supplier=Jameco; ComponentLink1Description: https://datasheet.ciiva.com/34302/1876768-34302941.pdf?src-supplier=Jameco; ComponentLink2URL: https://datasheet.ciiva.com/5557/rk73b-5557320.pdf?src-supplier=Mouser; ComponentLink2Description: https://datasheet.ciiva.com/5557/rk73b-5557320.pdf?src-supplier=Mouser; Supplier Part Number 1: 2019-RK73B1ETTP104JCT-ND
R1001 = CMP-01181-1: RES 453K OHM 1% 1/16W 0402; Manufacturer: Yageo Group; Power Dissipation: 62.5mW; Temperature Coefficient: 100ppm/°C; Working Voltage: 50V; China RoHS: Non-Compliant; Category: Chip SMD Resistors; Composition: Thick Film; Contact Plating: Tin; Height: 350µm; Lifecycle Status: Production; Manufacturer Part Number: RC0402FR-13453KL; Max Operating Temperature: 155°C; Min Operating Temperature: -55°C; Mounting Technology: Surface Mount; Number of Terminals: 2; Packaging: Tape & Reel; REACH SVHC: Yes; RoHS: Compliant; Width: 500µm
R1002 = CMP-01182-1: RES 453K OHM 1% 1/10W 0603; Manufacturer: Yageo Group; Power Dissipation: 100mW; Temperature Coefficient: 100ppm/°C; Voltage Rating: 75V; Voltage Rating (DC): 50V; Category: Chip SMD Resistors; Case Code (Imperial): 0603; Case/Package: 0603; China RoHS: Non-Compliant; Composition: Thick Film; Contact Plating: Tin; Depth: 800µm; Height: 450µm; Lead Free: Lead Free; Length: 1.6mm; Lifecycle Status: Production; Manufacturer Part Number: RC0603FR-07453KL; Max Operating Temperature: 155°C; Military Standard: Not; Min Operating Temperature: -55°C; Mounting Technology: Surface Mount; Number of Terminals: 2; Packaging: Tape & Reel; Power Rating: 100mW; REACH SVHC: Yes; RoHS: Compliant; Schedule B: 8533210045, 8533210045|8533210045, 8533210045|8533210045|8533210045, 8533210045|8533210045|8533210045|8533210045; Termination: SMD/SMT; Tolerance: 1%; Width: 800µm; Working Voltage: 75V
R1004 = CMP-ROOT-0056-10: RES SMD 49.9K OHM 1% 1/4W 0603; Manufacturer 1: Vishay Dale; Voltage Rating: 75V; Crossable(YES/NO): YES; Power Rating: 250mW; Temperature Coefficient: 100ppm/°C; Number of Terminations: 2; Weight: 7.1E-05oz; Manufacturer Part Number 1: CRCW060349K9FKEAHP; Case Code (Metric): 1608; Lead Free: Lead Free; Radiation Hardening: No; Height: 0.022inch; Tolerance: 1%; Min Operating Temperature: -55°C; Width: 0.033inch; Length: 1.6mm; Case Code (Imperial): 0603; Composition: Thick Film; Termination: SMD/SMT; Mount Type(SMD/TH): SMD; Contact Plating: Tin; Packaging: Tape and Reel; Mount: Surface Mount; Max Operating Temperature: 155°C; Package Quantity: 1; Max Power Dissipation: 250mW; Features: Automotive AEC-Q200
R1005 = CMP-01168-1: RES 5.1K OHM 5% 1/4W 0603; Manufacturer: ROHM; Max Power Dissipation: 250mW; Temperature Coefficient: 200ppm/°C; Voltage Rating: 150V; Category: Chip SMD Resistors; Case Code (Imperial): 0603; Case Code (Metric): 1608; Composition: Thick Film; Features: Automotive AEC-Q200; Height: 450µm; Length: 1.6002mm; Lifecycle Status: Production; Manufacturer Part Number: ESR03EZPJ512; Max Operating Temperature: 155°C; Min Operating Temperature: -55°C; Mounting Technology: Surface Mount; Number of Terminals: 2; Number of Terminations: 2; Packaging: Tape & Reel (TR); Power Dissipation: 250mW; Power Rating: 250mW; REACH SVHC: Yes; RoHS: Compliant; Schedule B: 8533210045, 8533210045|8533210045, 8533210045|8533210045|8533210045, 8533210045|8533210045|8533210045|8533210045; Tolerance: 5%; Width: 800µm; Working Voltage: 150V
R1006 R1007 = CMP-00115-2: RES 100K OHM 1% 1/10W 0603; Manufacturer 1: Stackpole Electronics Inc; Mount Type(SMD/TH): SMD; Max Power Dissipation: 100mW; Crossable(YES/NO): YES; Temperature Coefficient: 100ppm/°C; Packaging: Tape and Reel; Lead Free: Lead Free; Mount: Surface Mount; Contact Plating: Tin,Matte; Case Code (Metric): 1608; Composition: Thick Film; Radiation Hardening: No; Max Operating Temperature: 155°C; Features: Automotive AEC-Q200; Length: 0.061inch; Case Code (Imperial): 0603; Manufacturer Part Number 1: RMCF0603FG100K; Width: 0.031inch; Height: 0.022inch; Number of Terminations: 2; Min Operating Temperature: -55°C
R1008 R1009 R1011-R1014 = CMP-ROOT-0037-10: RES 0R 1/16W 1% 0402 SMD; Manufacturer 1: Stackpole Electronics Inc; Max Power Dissipation: 63mW; Crossable(YES/NO): YES; Current Rating: 1A; Working Voltage: 50V; Height: 0.016inch; Radiation Hardening: No; Max Operating Temperature: 155°C; Min Operating Temperature: -55°C; Lead Free: Lead Free; Contact Plating: Tin,Matte; Number of Terminations: 2; Features: Automotive AEC-Q200; Case Code (Metric): 1005; Mount: Surface Mount; Packaging: Tape and Reel; Width: 0.02inch; Mount Type(SMD/TH): SMD; Length: 0.039inch; Depth: 0.5mm; Composition: Thick Film; Power Rating: 63mW; Military Standard: Not; Case Code (Imperial): 0402; Manufacturer Part Number 1: RMCF0402ZT0R00; Case/Package: 0402
R1010 R1020-R1023 R1025 R1026 = CMP-00052-9: RES 0R 1/8W 0% 0805 SMD; Manufacturer 1: Stackpole Electronics Inc; Power Rating: 125mW; Crossable(YES/NO): YES; Packaging: Tape and Reel; Features: Automotive AEC-Q200; Military Standard: Not; Mount Type(SMD/TH): SMD; Length: 2mm; Radiation Hardening: No; Case Code (Metric): 2012; Composition: Thick Film; Manufacturer Part Number 1: RMCF0805ZT0R00; Max Operating Temperature: 155°C; Lead Free: Lead Free; Height: 0.026inch; Mount: Surface Mount; Contact Plating: Tin,Matte; Depth: 1.25mm; Case Code (Imperial): 0805; Max Power Dissipation: 125mW; Min Operating Temperature: -55°C; Width: 0.049inch; Number of Terminations: 2
R1015 R1027 R1028 = CMP-01105-1: RES 10K OHM 1% 1/16W 0402; Manufacturer: Stackpole Electronics; Package Length: 1mm; Package Height: 0.3mm; Package Width: 0.5mm; Power: 63mW; Rated Temperature: 70°C; Reference Standard: AEC-Q200; Temperature Coefficient (ppm/Cel): 100; Working Voltage: 50V; Category: Chip SMD Resistors; Construction: Rectangular; JESD-609 Code: e3; Manufacturer Part Number: RMCF0402FT10K0; Max Operating Temperature: 155°C; Min Operating Temperature: -55°C; Mounting Technology: Surface Mount; Pins: 2; Package Shape: Rectangular; Packaging: Tape and Reel; Reach SVHC Compliant: Yes; Resistor Type: FIXED RESISTOR; RoHS Compliant: Yes; Technology: METAL GLAZE/THICK FILM; Terminal Finish: Nickel; Termination: Wraparound
R1016 R1018 R1019 = CMP-00289-1: RES SMD 5.1K OHM 1% 1/16W 0402; Manufacturer 1: Rohm Semiconductor; Crossable(YES/NO): YES; Max Power Dissipation: 63mW; Voltage Rating (DC): 50V; Temperature Coefficient: 400ppm/°C; Width: 0.02inch; Number of Terminations: 2; Min Operating Temperature: -55°C; Mount Type(SMD/TH): SMD; Case Code (Metric): 1005; Depth: 0.5mm; Max Operating Temperature: 155°C; Composition: Thick Film; Features: Automotive AEC-Q200; Height: 0.016inch; Packaging: Tape and Reel; Package Quantity: 10000; Length: 0.039inch; Tolerance: 1%; Lead Free: Lead Free; Case Code (Imperial): 0402; Manufacturer Part Number 1: MCR01MZPF5101; Military Standard: Not
R1017 = CMP-01196-1: RES 1.5K OHM 1% 1/16W 0402; Manufacturer: Yageo Group; Max Power Dissipation: 63mW; Power Dissipation: 62.5mW; Temperature Coefficient: 100ppm/°C; Voltage Rating: 50V; Case/Package: 0402; Case Code (Imperial): 0402; Case Code (Metric): 0402; Category: Chip SMD Resistors; China RoHS: Non-Compliant; Composition: Thick Film; Depth: 500µm; Features: Moisture Resistant; Height: 350µm; Lead Free: Lead Free; Length: 1mm; Lifecycle Status: Production; Manufacturer Part Number: RC0402FR-071K5L; Max Operating Temperature: 155°C; Military Standard: Not; Min Operating Temperature: -55°C; Mounting Technology: Surface Mount; Pins: 2; Number of Terminals: 2; Number of Terminations: 2; Packaging: Cut Tape; Power Rating: 63mW; REACH SVHC: Yes; RoHS: Compliant; Schedule B: 8533210045, 8533210045|8533210045|8533210045|8533210045|8533210045|8533210045|8533210045|8533210045|8533210045|8533210045|8533210045|8533210045|8533210045|8533210045|8533210045|8533210045|8533210045|8533210045|8533210045|8533210045|8533210045|8533210045|8533210045|85; Termination: SMD/SMT; Tolerance: 1%; Voltage Rating (AC): 50V; Voltage Rating (DC): 50V; Width: 500µm; Working Voltage: 50V
R1024 = CMP-01195-1: RES SMD 51K OHM 1% 1/16W 0402; Manufacturer: Yageo Group; Max Power Dissipation: 63mW; Power Dissipation: 62.5mW; Temperature Coefficient: 100ppm/°C; Voltage Rating: 50V; Case/Package: 0402; Case Code (Imperial): 0402; Case Code (Metric): 1005; Category: Chip SMD Resistors; China RoHS: Non-Compliant; Composition: Thick Film; Features: Automotive AEC-Q200, Moisture Resistant; Height: 320µm; Lead Free: Lead Free; Length: 990.6µm; Lifecycle Status: Production; Manufacturer Part Number: AC0402FR-0751KL; Max Operating Temperature: 155°C; Min Operating Temperature: -55°C; Mounting Technology: Surface Mount; Number of Terminals: 2; Number of Terminations: 2; Packaging: Tape & Reel; Power Rating: 62.5mW; REACH SVHC: Yes; RoHS: Compliant; Schedule B: 8533210045, 8533210045|8533210045|8533210045|8533210045|8533210045|8533210045|8533210045|8533210045|8533210045|8533210045|8533210045|8533210045|8533210045|8533210045|8533210045|8533210045|8533210045|8533210045|8533210045|8533210045|8533210045|8533210045|8533210045|85; Termination: SMD/SMT; Weight: 652.039032µg; Width: 500µm; Working Voltage: 50V
TP1000-TP1013 = CMP-ROOT-0080-12: Test Point 1x1mm; Manufacturer Part Number 1: NA; Mount Type(SMD/TH): TH; Crossable(YES/NO): YES; Manufacturer 1: N/A
U1000 = CMP-01178-1: IC REG BUCK ADJ 3.5A 8SOPWR; Manufacturer: Texas Instruments; Manufacturer Lifecycle Status: ACTIVE; Category: Voltage Regulators - Switching; Height: 1.7mm; Length: 4.89mm; Lifecycle Status: Production; Manufacturer Part Number: LM5013DDAR; Pins: 8; RoHS: Compliant; Thickness: 1.48mm; Topology: Buck; Width: 3.9mm
U1001 = CMP-01149-1: SAFETY SYSTEM BASIS CHIP WITH LO; Manufacturer: NXP Semiconductors; Manufacturer Part Number: MFS2633AMDALAD; Category: Power Management - Specialized; Lifecycle Status: Production; REACH SVHC: Yes; RoHS: Compliant